# Altium schematic sheet Sheet4.SCHDOC
size 593 x 439 mm; DocumentNumber: ЕМС.02.00.200 Э3; SheetNumber: 4; SheetTotal: 4; DocumentName: Sheet4.SCHDOC
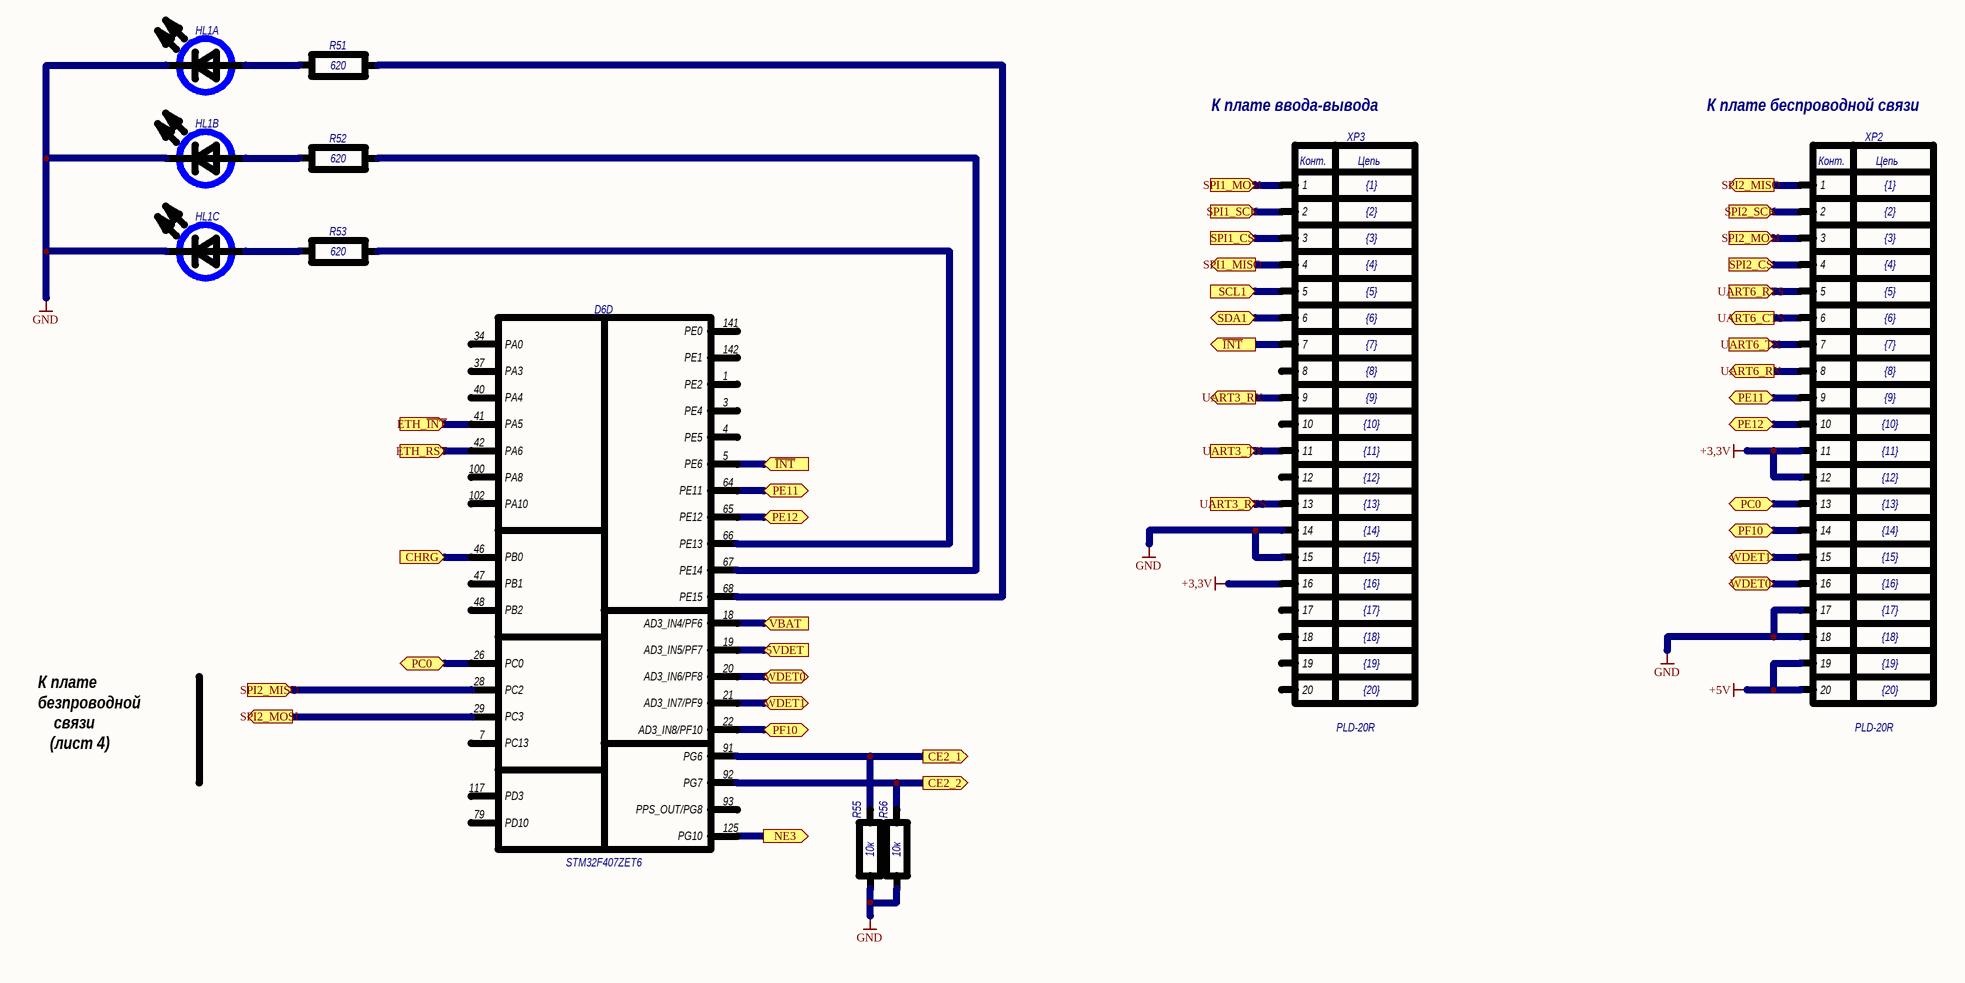
[diagram p0: Sheet4.SCHDOC]

## Parts
D6  STM32F407ZET6  [LQFP-144]  (part D of 4)
HL1  L-7104SA-3GD  [L-7104SA-3GD]  (value not drawn)  (parts A,B,C of 3)
R51  value 620  [0805]  (hidden comment: Р0805)
R52  value 620  [0805]  (hidden comment: Р0805)
R53  value 620  [0805]  (hidden comment: Р0805)
R55  Р0805  [0805]  (value not drawn)
R56  Р0805  [0805]  (value not drawn)
XP2  PLD-20R  18: {18}  15: {15}  12: {12}  9: {9}  6: {6}  3: {3}  1: {1}  19: {19}  16: {16}  20: {20}  17: {17}  13: {13}  10: {10}  14: {14}  11: {11}  7: {7}  4: {4}  8: {8}  5: {5}  2: {2}  [PLD-20R]
XP3  PLD-20R  18: {18}  15: {15}  12: {12}  9: {9}  6: {6}  3: {3}  1: {1}  19: {19}  16: {16}  20: {20}  17: {17}  13: {13}  10: {10}  14: {14}  11: {11}  7: {7}  4: {4}  8: {8}  5: {5}  2: {2}  [PLD-20R]

## Ports
5VDET (in), CE2_1 (out), CE2_2 (out), CHRG (in), ETH_RST (in), ETH_~{INT} (in), NE3 (out), PC0 (bidir), PE11 (bidir), PE12 (bidir), PF10 (bidir), SCL1 (in), SDA1 (bidir), SPI1_CS (in), SPI1_MISO (out), SPI1_MOSI (in), SPI1_SCK (in), SPI2_CS (in), SPI2_MISO (in), SPI2_MISO (out), SPI2_MOSI (in), SPI2_MOSI (out), SPI2_SCK (in), UART3_RTS (in), UART3_RX (out), UART3_TX (in), UART6_CTS (out), UART6_RTS (in), UART6_RX (out), UART6_TX (in), VBAT (in), WDET0 (bidir), WDET1 (bidir), ~{INT} (in), ~{INT} (out)

## Nets
+3,3V: XP2.11 XP2.12 XP3.16
+5V: XP2.19 XP2.20
GND: HL1.2 HL1.4 HL1.6 R55.1 R56.1 XP2.17 XP2.18 XP3.14 XP3.15
5VDET: D6.19(AD3_IN5/PF7) ; port 5VDET
CE2_1: D6.91(PG6) R55.2 ; port CE2_1
CE2_2: D6.92(PG7) R56.2 ; port CE2_2
CHRG: D6.46(PB0) ; port CHRG
ETH_~{INT}: D6.41(PA5) ; port ETH_~{INT}
ETH_RST: D6.42(PA6) ; port ETH_RST
~{INT}: D6.5(PE6) XP3.7 ; port ~{INT}
NE3: D6.125(PG10) ; port NE3
PC0: D6.26(PC0) XP2.13 ; port PC0
PE11: D6.64(PE11) XP2.9 ; port PE11
PE12: D6.65(PE12) XP2.10 ; port PE12
PF10: D6.22(AD3_IN8/PF10) XP2.14 ; port PF10
SCL1: XP3.5 ; port SCL1
SDA1: XP3.6 ; port SDA1
SPI1_CS: XP3.3 ; port SPI1_CS
SPI1_MISO: XP3.4 ; port SPI1_MISO
SPI1_MOSI: XP3.1 ; port SPI1_MOSI
SPI1_SCK: XP3.2 ; port SPI1_SCK
SPI2_CS: XP2.4 ; port SPI2_CS
SPI2_MISO: D6.28(PC2) XP2.1 ; port SPI2_MISO
SPI2_MOSI: D6.29(PC3) XP2.3 ; port SPI2_MOSI
SPI2_SCK: XP2.2 ; port SPI2_SCK
UART3_RTS: XP3.13 ; port UART3_RTS
UART3_RX: XP3.9 ; port UART3_RX
UART3_TX: XP3.11 ; port UART3_TX
UART6_CTS: XP2.6 ; port UART6_CTS
UART6_RTS: XP2.5 ; port UART6_RTS
UART6_RX: XP2.8 ; port UART6_RX
UART6_TX: XP2.7 ; port UART6_TX
VBAT: D6.18(AD3_IN4/PF6) ; port VBAT
WDET0: D6.20(AD3_IN6/PF8) XP2.16 ; port WDET0
WDET1: D6.21(AD3_IN7/PF9) XP2.15 ; port WDET1
NetD6_66: D6.66(PE13) R53.2
NetD6_67: D6.67(PE14) R52.2
NetD6_68: D6.68(PE15) R51.2
NetHL1_1: HL1.1 R51.1
NetHL1_3: HL1.3 R52.1
NetHL1_5: HL1.5 R53.1

Not connected (* = marked no-connect by the designer): D6 1(PE2) 3(PE4) 4(PE5) 7(PC13) 34(PA0) 37(PA3) 40(PA4) 47(PB1) 48(PB2) 49 79(PD10) 93(PPS_OUT/PG8) 100(PA8) 102(PA10) 117(PD3) 141(PE0) 142(PE1); XP3 8 10 12 17 18 19 20

## Notes on the sheet
- К плате ввода-вывода
- К плате беспроводной связи
- К плате
  безпроводной
  связи
  (лист 4)
- Подп. и дата
- Инв. № дубл.
- Взам. инв. №
- Инв. № подл.
- Лист
- Изм.
- № докум.
- Подп.
- Дата
- (in symbol PLD-20R) Конт.; Цепь
- (in symbol Р0805) 10к

## Library data of the parts
HL1 = L-7104SA-3GD: {Description}; 1: k; 2: a; TU: {TU}; TG: {TG}; TO: {TO}; NO: {NO}; RefDes2: {RefDes2}; ComponentHeight: {ComponentHeight}
R51-R53 R55 R56 = Р0805: РЕЗИСТОР; TG: 0,125; TO: 1%; TU: {TU}; NO: {NO}; RefDes2: {RefDes2}; ComponentHeight: 1
XP2 XP3 = PLD-20R: {Description}; TU: {TU}; TG: {TG}; RefDes2: {RefDes2}; TO: {TO}; NO: {NO}; ComponentHeight: {ComponentHeight}